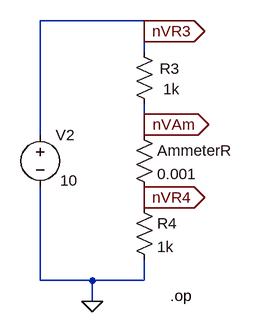
[diagram p0: schematic ammeter_as_R.asc]
ammeter_as_R.asc, the LTspice schematic file:
Version 4
SHEET 1 936 680
WIRE 560 -224 400 -224
WIRE 560 -208 560 -224
WIRE 560 -176 560 -208
WIRE 560 -64 560 -96
WIRE 400 -48 400 -224
WIRE 560 -48 560 -64
WIRE 560 48 560 32
WIRE 560 64 560 48
WIRE 400 176 400 32
WIRE 480 176 400 176
WIRE 560 176 560 144
WIRE 560 176 480 176
WIRE 480 208 480 176
FLAG 480 208 0
FLAG 560 -208 nVR3
IOPIN 560 -208 Out
FLAG 560 -64 nVAm
IOPIN 560 -64 Out
FLAG 560 48 nVR4
IOPIN 560 48 Out
SYMBOL voltage 400 -64 R0
WINDOW 3 31 86 Left 2
WINDOW 123 0 0 Left 0
WINDOW 39 0 0 Left 0
SYMATTR Value 10
SYMATTR InstName V2
SYMBOL res 544 -192 R0
WINDOW 0 40 42 Left 2
WINDOW 3 45 73 Left 2
SYMATTR InstName R3
SYMATTR Value 1k
SYMBOL res 544 48 R0
SYMATTR InstName R4
SYMATTR Value 1k
SYMBOL res 544 -64 R0
SYMATTR InstName AmmeterR
SYMATTR Value 0.001
TEXT 600 200 Left 2 !.op

The netlist it stands for:
* ammeter_as_R.asc
V2 nVR3 0 10
R3 nVR3 nVAm 1k
R4 nVR4 0 1k
R§AmmeterR nVAm nVR4 0.001
.op
.backanno
.end